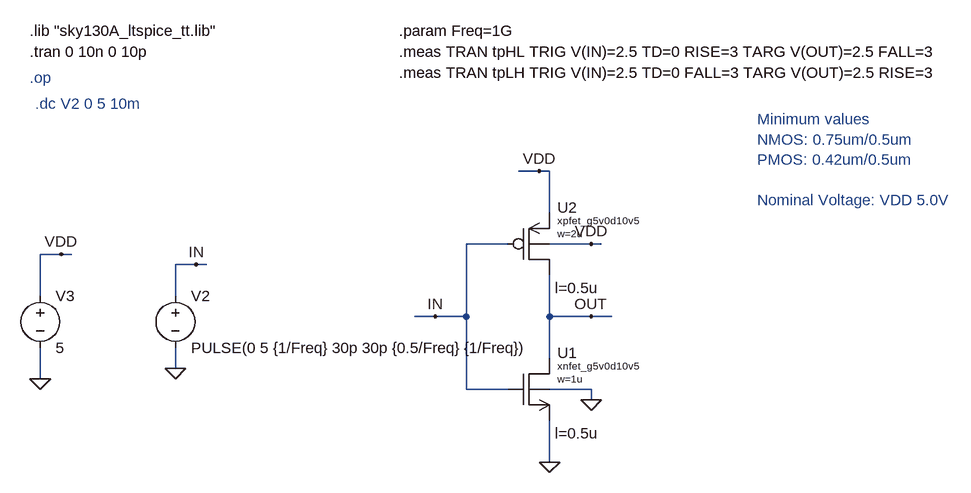
[diagram p0: schematic CMOS_Inverter_5V.asc]
CMOS_Inverter_5V.asc, the LTspice schematic file:
Version 4.1
SHEET 1 6080 1492
WIRE 912 -160 880 -160
WIRE 928 -160 912 -160
WIRE 928 -96 928 -160
WIRE 864 -48 800 -48
WIRE 992 -48 928 -48
WIRE 1008 -48 992 -48
WIRE 176 -32 144 -32
WIRE 192 -32 176 -32
WIRE 384 -16 352 -16
WIRE 400 -16 384 -16
WIRE 144 32 144 -32
WIRE 352 32 352 -16
WIRE 752 64 720 64
WIRE 800 64 800 -48
WIRE 800 64 752 64
WIRE 928 64 928 0
WIRE 992 64 928 64
WIRE 1024 64 992 64
WIRE 928 128 928 64
WIRE 352 144 352 112
WIRE 144 160 144 112
WIRE 800 176 800 64
WIRE 864 176 800 176
WIRE 992 176 928 176
WIRE 992 192 992 176
WIRE 928 288 928 224
FLAG 176 -32 VDD
FLAG 144 160 0
FLAG 352 144 0
FLAG 384 -16 IN
FLAG 912 -160 VDD
FLAG 992 -48 VDD
FLAG 928 288 0
FLAG 992 192 0
FLAG 752 64 IN
FLAG 992 64 OUT
SYMBOL voltage 144 16 R0
WINDOW 123 0 0 Left 0
WINDOW 39 0 0 Left 0
SYMATTR InstName V3
SYMATTR Value 5
SYMBOL voltage 352 16 R0
WINDOW 123 0 0 Left 0
WINDOW 39 0 0 Left 0
SYMATTR InstName V2
SYMATTR Value PULSE(0 5 {1/Freq} 30p 30p {0.5/Freq} {1/Freq})
SYMBOL xnch 880 128 R0
WINDOW 123 56 116 Left 2
SYMATTR Value2 l=0.5u
SYMATTR InstName U1
SYMATTR Value w=1u
SYMATTR SpiceModel xnfet_g5v0d10v5
SYMBOL xpch 880 -96 R0
WINDOW 123 56 116 Left 2
SYMATTR Value2 l=0.5u
SYMATTR InstName U2
SYMATTR Value w=2u
SYMATTR SpiceModel xpfet_g5v0d10v5
TEXT 128 -304 Left 2 ;.op
TEXT 128 -344 Left 2 !.tran 0 10n 0 10p
TEXT 696 -344 Left 2 !.meas TRAN tpHL TRIG V(IN)=2.5 TD=0 RISE=3 TARG V(OUT)=2.5 FALL=3
TEXT 696 -312 Left 2 !.meas TRAN tpLH TRIG V(IN)=2.5 TD=0 FALL=3 TARG V(OUT)=2.5 RISE=3
TEXT 136 -264 Left 2 ;.dc V2 0 5 10m
TEXT 696 -376 Left 2 !.param Freq=1G
TEXT 128 -376 Left 2 !.lib "sky130A_ltspice_tt.lib"
TEXT 1248 -240 Left 2 ;Minimum values\nNMOS: 0.75um/0.5um\nPMOS: 0.42um/0.5um\n \nNominal Voltage: VDD 5.0V

The netlist it stands for:
* CMOS_Inverter_5V.asc
V3 VDD 0 5
V2 IN 0 PULSE(0 5 {1/Freq} 30p 30p {0.5/Freq} {1/Freq})
X§U1 OUT IN 0 0 xnfet_g5v0d10v5 w=1u l=0.5u  ; pins D G S B
X§U2 OUT IN VDD VDD xpfet_g5v0d10v5 w=2u l=0.5u  ; pins D G S B
* .op
.tran 0 10n 0 10p
.meas TRAN tpHL TRIG V(IN)=2.5 TD=0 RISE=3 TARG V(OUT)=2.5 FALL=3
.meas TRAN tpLH TRIG V(IN)=2.5 TD=0 FALL=3 TARG V(OUT)=2.5 RISE=3
* .dc V2 0 5 10m
.param Freq=1G
.lib "sky130A_ltspice_tt.lib"
* Minimum values
* NMOS: 0.75um/0.5um
* PMOS: 0.42um/0.5um
* Nominal Voltage: VDD 5.0V
.backanno
.end